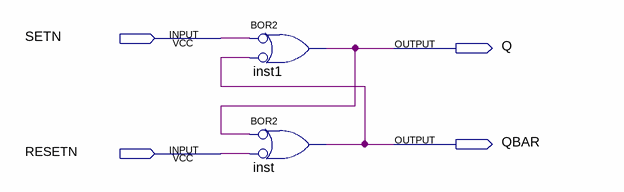
[diagram p0: schematic sheet]
// Quartus schematic lab_5.bdf as structural Verilog: 2 symbols, 4 pins
module lab_5 (
  input  SETN,
  input  RESETN,
  output Q,
  output QBAR
);

  or inst1 (Q, ~SETN, ~QBAR);  // BOR2
  or inst (QBAR, ~Q, ~RESETN);  // BOR2
endmodule
